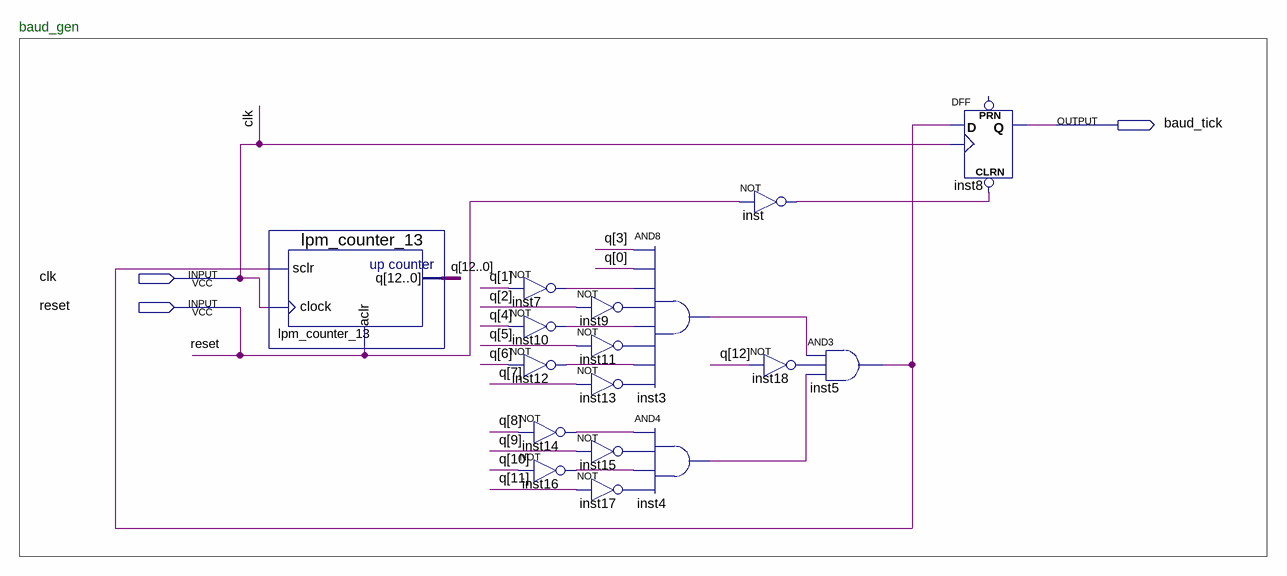
[diagram p0: schematic sheet]
// Quartus schematic baud_gen_.bdf as structural Verilog: 17 symbols, 3 pins
module baud_gen_ (
  input  clk,
  input  reset,
  output baud_tick
);

  wire inst3_out, inst4_out, inst5_out, inst7_out, inst9_out, inst10_out, inst11_out, inst12_out, inst13_out,
       inst14_out, inst15_out, inst16_out, inst17_out, inst18_out, inst_out;
  wire [12:0] q;

  lpm_counter_13 lpm_counter_13 (.sclr(inst5_out), .clock(clk), .aclr(reset), .q(q));
  not inst7 (inst7_out, q[1]);
  not inst9 (inst9_out, q[2]);
  not inst10 (inst10_out, q[4]);
  not inst11 (inst11_out, q[5]);
  not inst12 (inst12_out, q[6]);
  not inst13 (inst13_out, q[7]);
  not inst14 (inst14_out, q[8]);
  not inst15 (inst15_out, q[9]);
  not inst16 (inst16_out, q[10]);
  not inst17 (inst17_out, q[11]);
  and inst3 (inst3_out, q[3], q[0], inst7_out, inst9_out, inst10_out, inst11_out, inst12_out, inst13_out);
  and inst4 (inst4_out, inst14_out, inst15_out, inst16_out, inst17_out);
  not inst (inst_out, reset);
  and inst5 (inst5_out, inst3_out, inst18_out, inst4_out);
  not inst18 (inst18_out, q[12]);
  DFF inst8 (.CLRN(inst_out), .CLK(clk), .D(inst5_out), .Q(baud_tick));  // open: PRN

  // Notes on the sheet:
  //   baud_gen
endmodule
